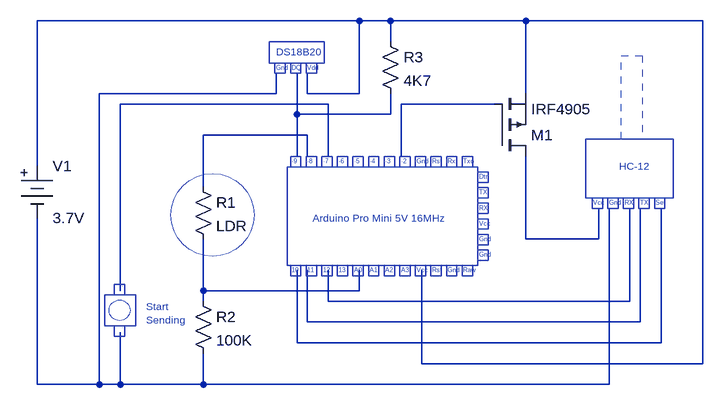
[diagram p0: schematic ArduinoProMini.asc]
ArduinoProMini.asc, the LTspice schematic file:
Version 4
SHEET 1 880 680
WIRE 48 -160 -448 -160
WIRE 96 -160 48 -160
WIRE 304 -160 96 -160
WIRE 576 -160 304 -160
WIRE 96 -128 96 -160
WIRE -80 -48 -80 -80
WIRE -80 -48 -352 -48
WIRE -32 -48 -32 -80
WIRE 48 -48 48 -160
WIRE 48 -48 -32 -48
WIRE 304 -48 304 -160
WIRE 0 -32 -320 -32
WIRE 256 -32 112 -32
WIRE -48 -16 -48 -80
WIRE 96 -16 96 -48
WIRE 96 -16 -48 -16
WIRE 112 48 112 -32
WIRE -32 16 -192 16
WIRE -48 48 -48 -16
WIRE -32 48 -32 16
WIRE 0 48 0 -32
WIRE -448 64 -448 -160
WIRE -192 96 -192 16
WIRE 304 176 304 48
WIRE 416 176 416 128
WIRE 416 176 304 176
WIRE -320 256 -320 -32
WIRE -192 256 -192 176
WIRE 48 256 48 224
WIRE 48 256 -192 256
WIRE -192 272 -192 256
WIRE 0 272 0 224
WIRE 464 272 464 128
WIRE 464 272 0 272
WIRE -32 304 -32 224
WIRE 480 304 480 128
WIRE 480 304 -32 304
WIRE -48 336 -48 224
WIRE 512 336 512 128
WIRE 512 336 -48 336
WIRE 144 368 144 224
WIRE 576 368 576 -160
WIRE 576 368 144 368
WIRE -448 400 -448 144
WIRE -352 400 -352 -48
WIRE -352 400 -448 400
WIRE -320 400 -320 320
WIRE -320 400 -352 400
WIRE -192 400 -192 352
WIRE -192 400 -320 400
WIRE 432 400 432 128
WIRE 432 400 -192 400
SYMBOL res -208 80 R0
SYMATTR InstName R1
SYMATTR Value LDR
SYMBOL res -208 256 R0
SYMATTR InstName R2
SYMATTR Value 100K
SYMBOL pmos 256 48 M180
SYMATTR InstName M1
SYMATTR Value IRF4905
SYMBOL res 80 -144 R0
SYMATTR InstName R3
SYMATTR Value 4K7
SYMBOL Misc\\battery -448 48 R0
SYMATTR InstName V1
SYMATTR Value 3.7V
TEXT -56 224 Left 0 ;10
TEXT -32 224 Left 0 ;11
TEXT -8 224 Left 0 ;12
TEXT 16 224 Left 0 ;13
TEXT 40 224 Left 0 ;A0
TEXT 64 224 Left 0 ;A1
TEXT 88 224 Left 0 ;A2
TEXT 112 224 Left 0 ;A3
TEXT 136 224 Left 0 ;Vcc
TEXT 160 224 Left 0 ;Rst
TEXT 184 224 Left 0 ;Gnd
TEXT 208 224 Left 0 ;Raw
TEXT -56 56 Left 0 ;·9
TEXT -32 56 Left 0 ;·8
TEXT -8 56 Left 0 ;·7
TEXT 16 56 Left 0 ;·6
TEXT 40 56 Left 0 ;·5
TEXT 64 56 Left 0 ;·4
TEXT 88 56 Left 0 ;·3
TEXT 112 56 Left 0 ;·2
TEXT 136 56 Left 0 ;Gnd
TEXT 160 56 Left 0 ;Rst
TEXT 184 56 Left 0 ;Rxi
TEXT 208 56 Left 0 ;Txo
TEXT 232 80 Left 0 ;Dtr
TEXT 232 104 Left 0 ;TX
TEXT 232 128 Left 0 ;RX
TEXT 232 152 Left 0 ;Vcc
TEXT 232 176 Left 0 ;Gnd
TEXT 232 200 Left 0 ;Gnd
TEXT -24 144 Left 1 ;Arduino Pro Mini 5V 16MHz
TEXT 408 120 Left 0 ;Vcc
TEXT 432 120 Left 0 ;Gnd
TEXT 456 120 Left 0 ;RX
TEXT 480 120 Left 0 ;TX
TEXT 504 120 Left 0 ;Set
TEXT 448 64 Left 1 ;HC-12
TEXT -320 312 VRight 0 ;.
TEXT -320 248 VRight 0 ;.
TEXT -80 -88 Left 0 ;Gnd
TEXT -56 -88 Left 0 ;DQ
TEXT -32 -88 Left 0 ;Vdd
TEXT -80 -112 Left 1 ;DS18B20
TEXT -280 280 Left 1 ;Start\nSending
RECTANGLE Normal 230 217 -63 65
RECTANGLE Normal -42 217 -58 233
RECTANGLE Normal -18 217 -34 233
RECTANGLE Normal 6 217 -10 233
RECTANGLE Normal 30 217 14 233
RECTANGLE Normal 54 217 38 233
RECTANGLE Normal 78 217 62 233
RECTANGLE Normal 102 217 86 233
RECTANGLE Normal 126 217 110 233
RECTANGLE Normal 150 217 134 233
RECTANGLE Normal 174 217 158 233
RECTANGLE Normal 198 217 182 233
RECTANGLE Normal 222 217 206 233
RECTANGLE Normal -42 49 -58 65
RECTANGLE Normal -18 49 -34 65
RECTANGLE Normal 6 49 -10 65
RECTANGLE Normal 30 49 14 65
RECTANGLE Normal 54 49 38 65
RECTANGLE Normal 78 49 62 65
RECTANGLE Normal 102 49 86 65
RECTANGLE Normal 126 49 110 65
RECTANGLE Normal 150 49 134 65
RECTANGLE Normal 174 49 158 65
RECTANGLE Normal 198 49 182 65
RECTANGLE Normal 222 49 206 65
RECTANGLE Normal 246 73 230 89
RECTANGLE Normal 246 97 230 113
RECTANGLE Normal 246 121 230 137
RECTANGLE Normal 246 145 230 161
RECTANGLE Normal 246 169 230 185
RECTANGLE Normal 246 193 230 209
RECTANGLE Normal 531 113 396 22
RECTANGLE Normal 422 113 406 129
RECTANGLE Normal 446 113 430 129
RECTANGLE Normal 470 113 454 129
RECTANGLE Normal 494 113 478 129
RECTANGLE Normal 518 113 502 129
RECTANGLE Normal 483 22 451 -106 2
RECTANGLE Normal -344 310 -296 262
RECTANGLE Normal -313 326 -329 310
RECTANGLE Normal -313 262 -329 246
RECTANGLE Normal -6 -95 -91 -128
RECTANGLE Normal -66 -95 -82 -79
RECTANGLE Normal -42 -95 -58 -79
RECTANGLE Normal -18 -95 -34 -79
CIRCLE Normal -337 302 -305 270 1
CIRCLE Normal -114 203 -242 75 2

The netlist it stands for:
* ArduinoProMini.asc
R1 N006 N008 LDR
R2 N008 N002 100K
M1 N007 N004 N001 N001 IRF4905
R3 N001 N005 4K7
V1 N001 N002 3.7V
.model NMOS NMOS
.model PMOS PMOS
.lib standard.mos
* 10
* 11
* 12
* 13
* A0
* A1
* A2
* A3
* Vcc
* Rst
* Gnd
* Raw
* ·9
* ·8
* ·7
* ·6
* ·5
* ·4
* ·3
* ·2
* Gnd
* Rst
* Rxi
* Txo
* Dtr
* TX
* RX
* Vcc
* Gnd
* Gnd
* Arduino Pro Mini 5V 16MHz
* Vcc
* Gnd
* RX
* TX
* Set
* HC-12
* .
* .
* Gnd
* DQ
* Vdd
* DS18B20
* Start
* Sending
.backanno
.end